# EAGLE design MurataSD (EAGLE 7.5.0)
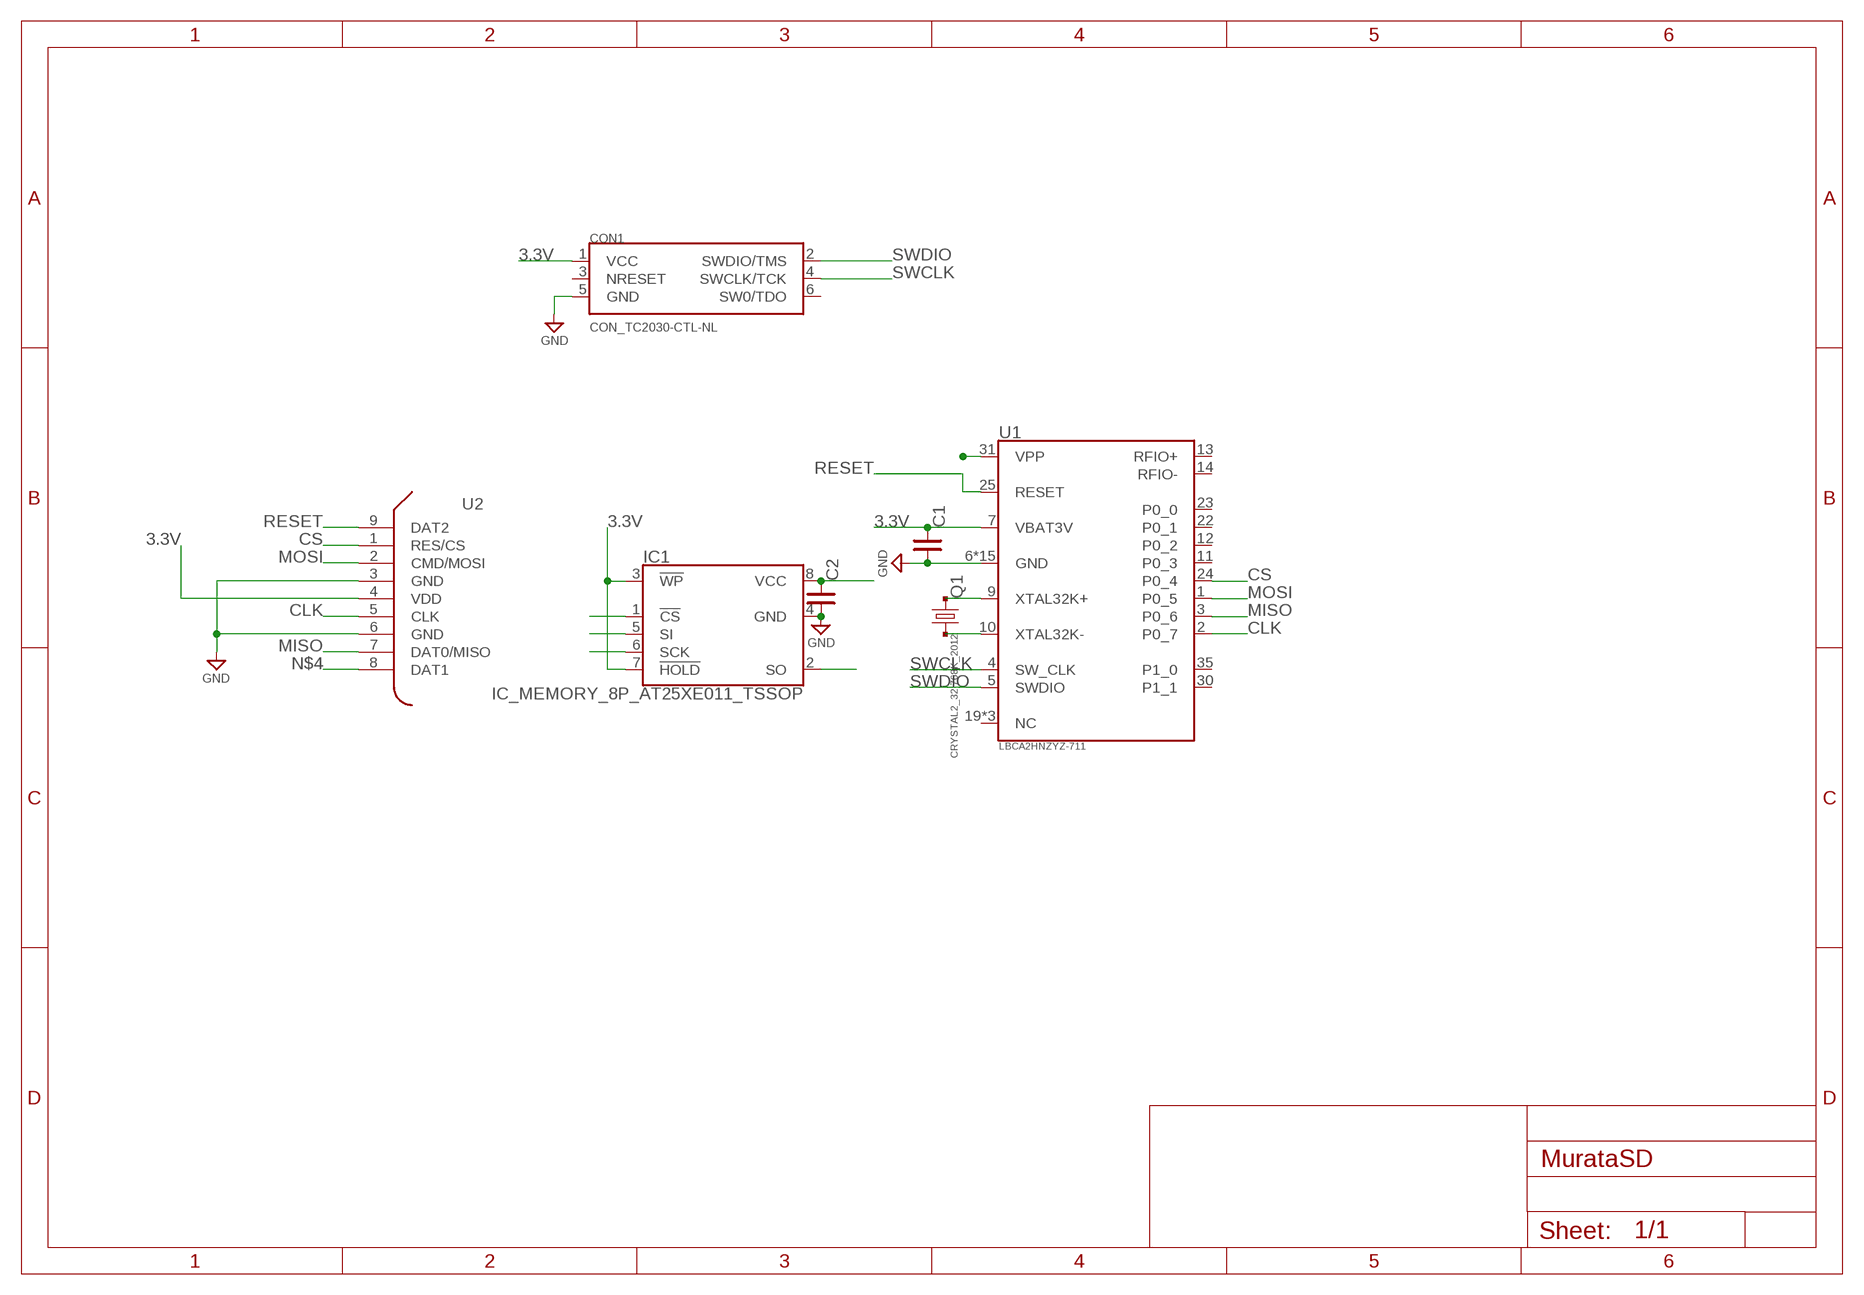
[diagram p0: schematic, sheet 1]

## Parts
C1  C_SMD_0.1U_1005  [C0402]
C2  C_SMD_0.1U_1005  [C0402]
CON1  CON_TC2030-CTL-NL  [CON_TC2030-IDC-NL]
IC1  IC_MEMORY_8P_AT25XE011_TSSOP  [IC_08_0.65_160MIL]
Q1  CRYSTAL2_32.768K_2012  [CR_2125]
U1  LBCA2HNZYZ-711  [IC_MURATA_LBCA2HNZYZ-711]
U2  BOARD_MMC  [BOARD_MMC]

## Nets
3.3V: C1.1 C2.1 CON1.1(VCC) IC1.3(!WP) IC1.7(!HOLD) IC1.8(VCC) U1.7(VBAT3V) U2.4(VDD)
CLK: IC1.6(SCK) U1.2(P0_7) U2.5(CLK)
CS: IC1.1(!CS) U1.24(P0_4) U2.1(RES/CS)
GND: C1.2 C2.2 CON1.5(GND) IC1.4(GND) U1.6(GND) U1.8(GND) U1.15(GND) U1.16(GND) U1.17(GND) U1.18(GND) U1.20(GND) U1.21(GND) U1.26(GND) U1.27(GND) U1.28(GND) U1.29(GND) U1.32(GND) U1.33(GND) U1.34(GND) U2.3(GND) U2.6(GND)
MISO: IC1.2(SO) U1.3(P0_6) U2.7(DAT0/MISO)
MOSI: IC1.5(SI) U1.1(P0_5) U2.2(CMD/MOSI)
N$1: Q1.1 U1.9(XTAL32K+)
N$2: Q1.2 U1.10(XTAL32K-)
N$4: U2.8(DAT1)
N$5: U1.31(VPP)
RESET: U1.25(RESET) U2.9(DAT2)
SWCLK: CON1.4(SWCLK/TCK) U1.4(SW_CLK)
SWDIO: CON1.2(SWDIO/TMS) U1.5(SWDIO)
Unconnected: CON1.3(NRESET) CON1.6(SW0/TDO) U1.11(P0_3) U1.12(P0_2) U1.13(RFIO+) U1.14(RFIO-) U1.19(NC) U1.22(P0_1) U1.23(P0_0) U1.30(P1_1) U1.35(P1_0) U1.36(NC) U1.37(NC)

## Library data of the parts
C1 C2 = mylib:C_SMD_*: SMD CAPACITOR : PAD - PAD; DIGIKEY: 490-3261-1-ND
CON1 = mylib:CON_TC2030
IC1 = mylib:IC_MEMORY_8P_*; DIGIKEY: 1265-1184-5-ND; MOUSER: !non-stock! 988-AT25XE011-SSHN-B
Q1 = mylib:CRYSTAL2_*; DIGIKEY: 1253-1342-1-ND
U1 = mylib:LBCA2HNZYZ-711; DIGIKEY: 490-10561-1-ND; MOUSER: 81-LBCA2HNZYZ-711
U2 = mylib:BOARD_MMC

## Board
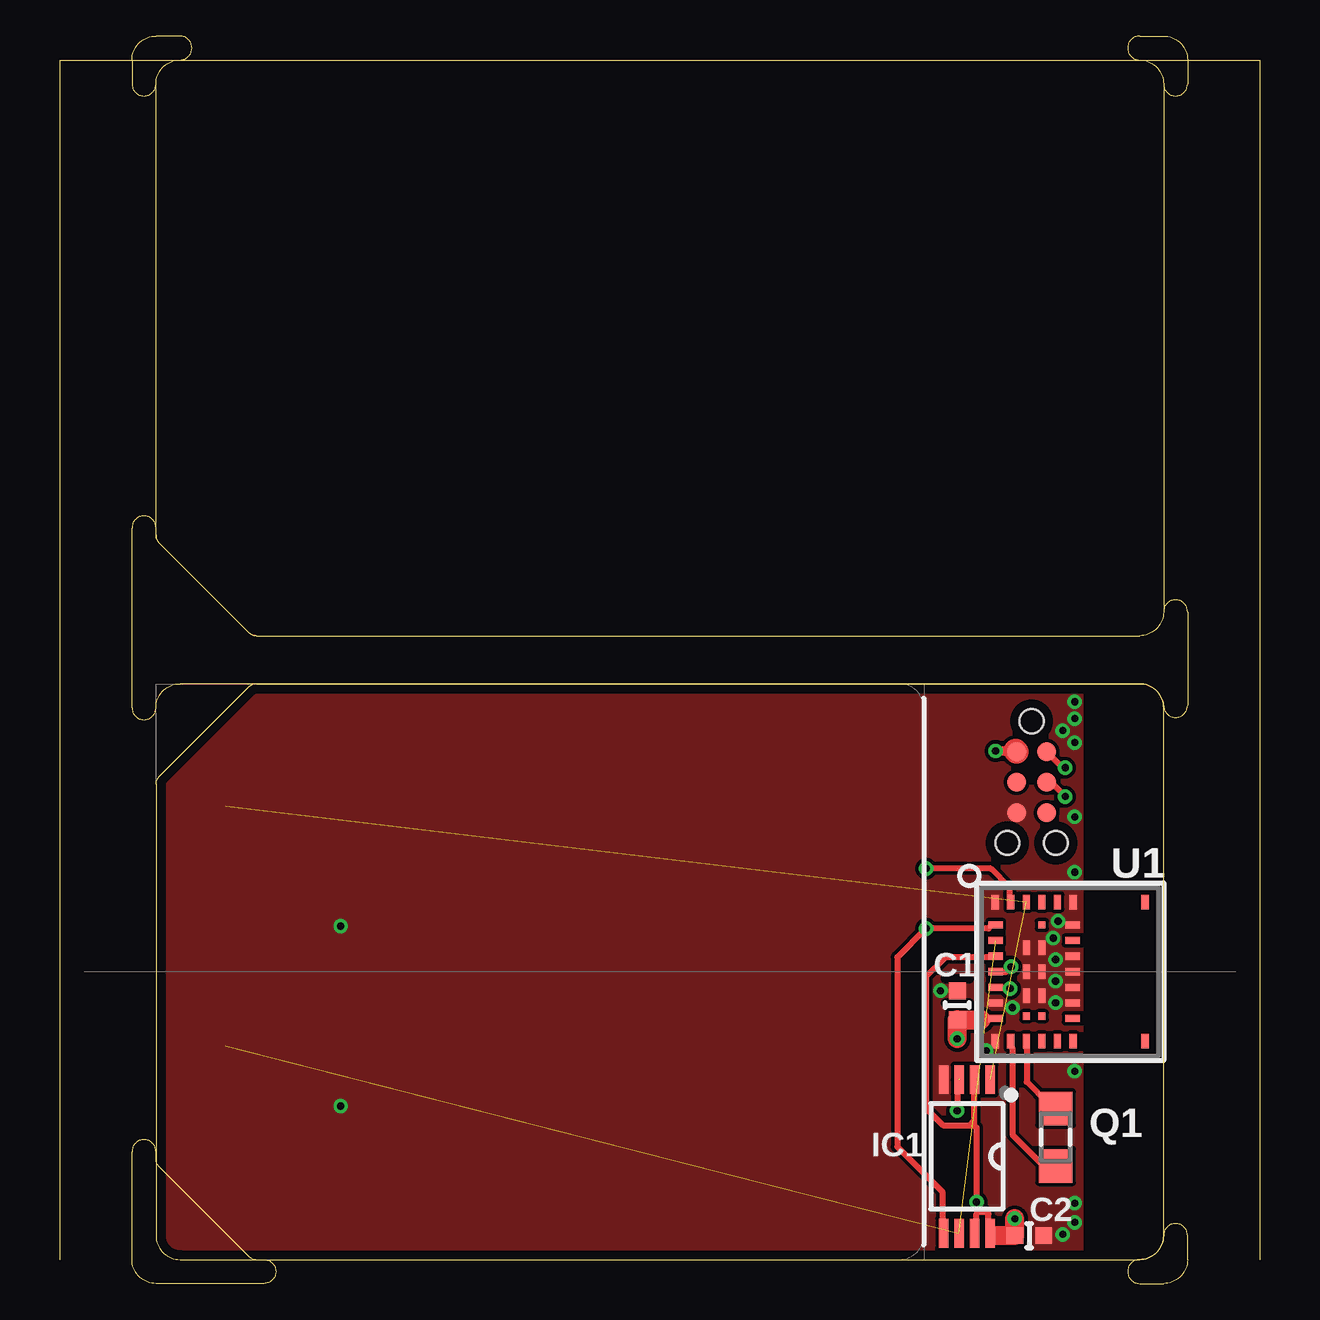
[diagram p1: board, top side]
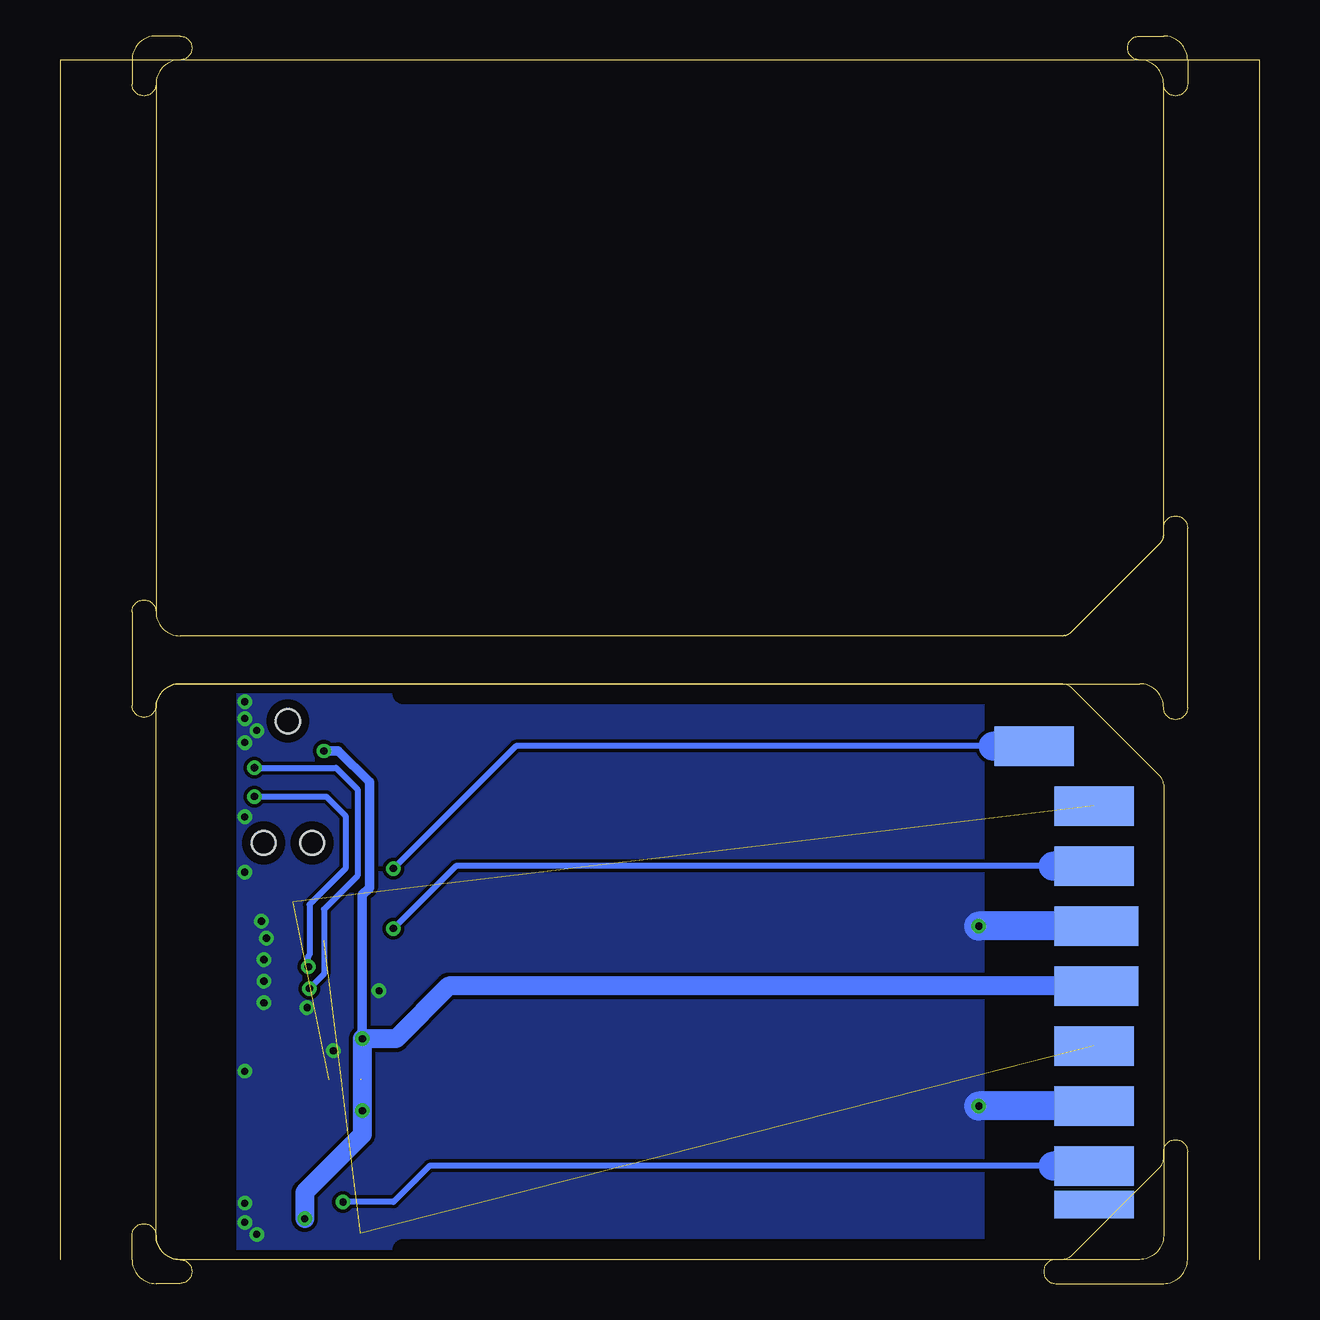
[diagram p2: board, bottom side, seen from below]

Size 50 x 50 mm. Coordinates in mm from the lower left corner, seen from the top.
Outline: 0,0 0,50 50,50 50,0
Outline: 4.15,20.15 7.85,23.85 arc-45 8.21,24 45,24 arc-90 46,23 46,1 arc-90 45,0 5,0 arc-90 4,1 4,19.79 arc-45 4.15,20.15
Outline: 4.15,29.85 7.85,26.15 arc45 8.21,26 45,26 arc90 46,27 46,49 arc90 45,50 5,50 arc90 4,49 4,30.21 arc45 4.15,29.85
Copper layers (1*16): Top 0.035mm / dielectric 1.5mm / Bottom 0.035mm
Design rules "SeeedStudio_2layer_DRU_no_angle_20140221 *": minimum track width 0.15mm, minimum drill 0.3mm, track to track 0.15mm, track to pad 0.15mm, pad to pad 0.15mm, via to via 0.15mm, smd to smd 0mil, copper to edge 0.4mm, drill to drill 10mil, minimum pad ring 10mil, minimum via ring 0.15mm, stop-mask expansion 0.05mm, vias tented up to drill 100mil, thermal gap 10mil
tRestrict: area 42.8,0 to 46,24; 2 lines
bRestrict: area 42.8,0 to 46,24
Milling: 43 lines

### Footprints (pad centres in the part's own frame; a part is rotated, then mirrored left to right if it is on the bottom)
C0402 = smd 0.7 x 0.7: 1 -0.6,0; 2 0.6,0
CON_TC2030-IDC-NL = smd 0.787 x 0.787: 1 -1.27,-0.635; 2 -1.27,0.635; 3 0,-0.635; 4 0,0.635; 5 1.27,-0.635; 6 1.27,0.635 | hole 0.991: -2.54,0; 2.54,1.016; 2.54,-1.016
IC_08_0.65_160MIL = smd 0.4 x 1.2: 1 -0.975,-3.2; 2 -0.325,-3.2; 3 0.325,-3.2; 4 0.975,-3.2; 5 0.975,3.2; 6 0.325,3.2; 7 -0.325,3.2; 8 -0.975,3.2
CR_2125 = smd 1.4 x 1.4: 1 -1.2,0; 2 1.2,0
IC_MURATA_LBCA2HNZYZ-711 = smd 0.3 x 0.6: 1 1.55,0.6; 2 2.2,0.6; 3 2.85,0.6; 4 3.5,0.6; 5 4.15,0.6; 6 4.8,0.6; 7 5.45,0.6; 14 5.45,3.8; 15 4.8,3.8; 16 4.15,3.8; 17 3.5,3.8; 18 2.85,3.8; 19 2.2,3.8; 20 1.55,3.8 | smd 0.6 x 0.3: 8 6.4,0.575; 9 6.4,1.225; 10 6.4,1.875; 11 6.4,2.525; 12 6.4,3.175; 13 6.4,3.825; 21 0.6,3.825; 22 0.6,3.175; 23 0.6,2.525; 24 0.6,1.875; 25 0.6,1.225; 26 0.6,0.575; 27 2.5,1.875; 28 3.5,1.875; 29 4.5,1.875; 32 4.5,2.525; 33 3.5,2.525; 34 2.5,2.525; 36 6.4,6.825; 37 0.6,6.825 | smd 0.3 x 0.3: 30 5.35,1.875; 31 5.35,2.525; 35 1.55,2.525
BOARD_MMC = smd 3.3 x 1.65 bottom: 1 2.9,18.9; 2 2.9,16.4; 5 2.9,8.9; 6 2.9,6.4; 7 2.9,3.9; 9 5.4,21.4 | smd 3.5 x 1.65 bottom: 3 2.8,13.9; 4 2.8,11.4 | smd 3.3 x 1.15 bottom: 8 2.9,2.3

### Placement (x,y rotation side)
C1  37.4,10.6 90 top
C2  40.4,1 0 top
CON1  40.5,19.9 270 top
IC1  37.8,4.3 180 top
Q1  41.5,5.1 90 top
U1  38.4,15.5 270 top
U2  4,0 0 top

### Tracks (layer width: path | path; a pad name or v marks a point on that pad's centre or on a via)
3.3V  (via drill 0.3)  (1 unrouted)
  Top 0.25: U1.7 38.45,10.05 38.4,10 | 39,1 38.88,1 IC1.8 38.77,1.12 38.7,1.2 38.7,1.9 38.6,2 38.3,2 38.2,1.9 38.2,1.5 38.12,1.43 IC1.7 | 37.48,7.53 37.42,7.53 37.4,7.5 v37.4,6.2
  Top 0.4: v39,21.2 39.84,21.2
  Top 0.8: v37.4,9.2 C1.1 38.4,10 | 39,1 C2.1 v39.8,1.7
  Top 1: 39.84,21.2 CON1.1
  Bottom 0.4: v39,21.2 38.4,21.2 37.1,19.9 37.1,15.5 37.4,15.2 v37.4,9.2
  Bottom 0.8: U2.4 33.8,11.4 36,9.2 v37.4,9.2 v37.4,6.2 37.4,5.2 39.8,2.8 v39.8,1.7
CLK  (2 unrouted)
CS  (2 unrouted)
GND  (via drill 0.3)
  Bottom 1.2: U2.3 v11.7,13.9 | U2.6 v11.7,6.4
  other vias: 41.8,1.05 38.6,8.7 42.3,1.55 42.3,2.35 42.3,7.85 42.3,16.15 42.3,18.45 42.3,21.55 41.8,22.05 42.3,22.55 42.3,23.25 39.7,10.5 36.7,11.2 41.5,10.7 41.5,11.6 41.5,12.5 41.4,13.4 41.6,14.1
  pour Top (isolate 0.15, no thermals): 4,24 46,24 46,0 4,0
  pour Bottom (isolate 0.15): 4,24 46,24 46,0 4,0
MISO  (via drill 0.3)
  Top 0.25: IC1.2 38.12,7.42 38.1,7.4 38.1,5.8 | 38.1,5.8 38.1,5.6 | U1.3 38.85,12.65 38.8,12.6 36.9,12.6 36.1,11.8 36.1,6.3 36.8,5.6 37.9,5.6 | 37.9,5.6 38.1,5.6 | 38.1,5.6 38.2,5.5 v38.2,2.4 | 37.9,5.6 38.1,5.8
  Bottom 0.25: 8.6,3.9 34.6,3.9 36.1,2.4 v38.2,2.4
  Bottom 1.2: U2.7 8.6,3.9
MOSI  (via drill 0.3)
  Top 0.25: IC1.5 36.83,1.18 36.8,1.2 36.8,2.8 34.9,4.7 34.9,12.6 v36.1,13.8 38.7,13.8 38.85,13.95 U1.1
  Bottom 0.25: v36.1,13.8 33.5,16.4 8.6,16.4
  Bottom 1.2: U2.2 8.6,16.4
N$1
  Top 0.25: Q1.1 41.2,3.7 39.7,5.2 39.7,8.8 39.62,8.88 U1.9
N$2
  Top 0.25: Q1.2 41.2,6.5 40.3,7.4 40.3,8.8 40.27,8.82 U1.10
RESET  (via drill 0.3)
  Top 0.25: U1.25 39.62,15.07 39.6,15.1 39.6,15.5 38.8,16.3 v36.1,16.3
  Bottom 0.25: 11.1,21.4 31,21.4 v36.1,16.3
  Bottom 1.2: U2.9 11.1,21.4
SWCLK  (via drill 0.3)
  Top 0.25: CON1.4 41.13,19.86 41.2,19.8 41.4,19.8 v41.9,19.3 | U1.4 39.45,12 v39.65,12.2
  Bottom 0.25: v41.9,19.3 38.9,19.3 38.1,18.5 38.1,16.3 39.6,14.8 39.6,12.7 39.65,12.65 v39.65,12.2
SWDIO  (via drill 0.3)
  Top 0.25: CON1.2 41.8,20.5 v41.9,20.5 | U1.5 39.55,11.35 v39.6,11.3
  Bottom 0.25: v41.9,20.5 38.5,20.5 37.6,19.6 37.6,16 39,14.6 39,11.9 v39.6,11.3